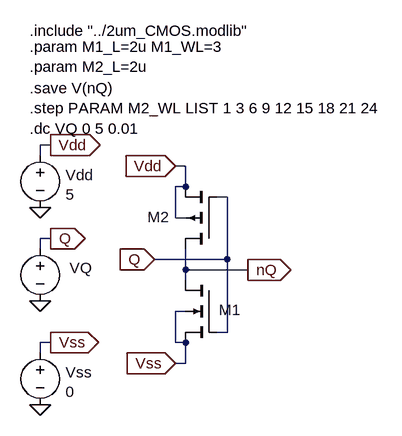
[diagram p0: schematic inverter.asc]
inverter.asc, the LTspice schematic file:
Version 4
SHEET 1 1180 1172
WIRE -528 -16 -544 -16
WIRE -544 0 -544 -16
WIRE -320 16 -336 16
WIRE -320 48 -320 16
WIRE -320 48 -336 48
WIRE -256 64 -272 64
WIRE -336 96 -336 48
WIRE -320 96 -336 96
WIRE -528 128 -544 128
WIRE -544 144 -544 128
WIRE -256 160 -256 64
WIRE -256 160 -368 160
WIRE -320 176 -320 144
WIRE -224 176 -320 176
WIRE -320 192 -320 176
WIRE -320 240 -336 240
WIRE -256 272 -256 160
WIRE -256 272 -272 272
WIRE -528 288 -544 288
WIRE -336 288 -336 240
WIRE -320 288 -336 288
WIRE -544 304 -544 288
WIRE -320 320 -320 288
WIRE -320 320 -336 320
FLAG -544 80 0
FLAG -528 -16 Vdd
IOPIN -528 -16 Out
FLAG -336 320 Vss
IOPIN -336 320 In
FLAG -336 16 Vdd
IOPIN -336 16 In
FLAG -224 176 nQ
IOPIN -224 176 Out
FLAG -544 384 0
FLAG -528 288 Vss
IOPIN -528 288 Out
FLAG -368 160 Q
IOPIN -368 160 In
FLAG -544 224 0
FLAG -528 128 Q
IOPIN -528 128 Out
SYMBOL pmos4 -272 144 R180
WINDOW 0 73 49 Left 2
WINDOW 3 55 45 Invisible 2
SYMATTR InstName M2
SYMATTR Value P_2u
SYMATTR Value2 l={M2_L} w={M2_L*M2_WL}
SYMBOL nmos4 -272 192 M0
WINDOW 0 -37 46 Left 2
WINDOW 3 -70 42 Invisible 2
SYMATTR InstName M1
SYMATTR Value N_2u
SYMATTR Value2 l={M1_L} w={M1_L*M1_WL}
SYMBOL voltage -544 -16 R0
WINDOW 0 39 46 Left 2
WINDOW 3 39 76 Left 2
SYMATTR InstName Vdd
SYMATTR Value 5
SYMBOL voltage -544 288 R0
WINDOW 0 39 46 Left 2
WINDOW 3 39 76 Left 2
SYMATTR InstName Vss
SYMATTR Value 0
SYMBOL voltage -544 128 R0
WINDOW 0 45 45 Left 2
WINDOW 3 45 74 Left 2
SYMATTR InstName VQ
SYMATTR Value ""
TEXT -560 -192 Left 2 !.include "../2um_CMOS.modlib"
TEXT -560 -168 Left 2 !.param M1_L=2u M1_WL=3\n.param M2_L=2u
TEXT -560 -104 Left 2 !.save V(nQ)\n.step PARAM M2_WL LIST 1 3 6 9 12 15 18 21 24\n.dc VQ 0 5 0.01

The netlist it stands for:
* inverter.asc
M2 nQ Q Vdd Vdd P_2u l={M2_L} w={M2_L*M2_WL}
M1 nQ Q Vss Vss N_2u l={M1_L} w={M1_L*M1_WL}
Vdd Vdd 0 5
Vss Vss 0 0
VQ Q 0
.model NMOS NMOS
.model PMOS PMOS
.lib standard.mos
.include "../2um_CMOS.modlib"
.param M1_L=2u M1_WL=3
.param M2_L=2u
.save V(nQ)
.step PARAM M2_WL LIST 1 3 6 9 12 15 18 21 24
.dc VQ 0 5 0.01
.backanno
.end